# Altium schematic sheet Принципиальная схема_V_№2.SchDoc: Преобразователь
size 420 x 297 mm; CheckedBy: Эпштейн Л.Б.; Author: Гусев И.С.; CompanyName: ИЯФ СО РАН; DrawnBy: 32; Address1: Address1; Address2: Address2; Address3: Address3; Address4: Address4; DocumentNumber: АБВГ.123456.001 Э3; Revision: 0; SheetNumber: 1; SheetTotal: 1; Scale: 1:1; Letter1Column: 1; DocumentType: Схема электрическая принципиальная; FirstReferrence: АБВГ.123456.001; DocumentName: 12; Rule: PcbType=ProtelPcb
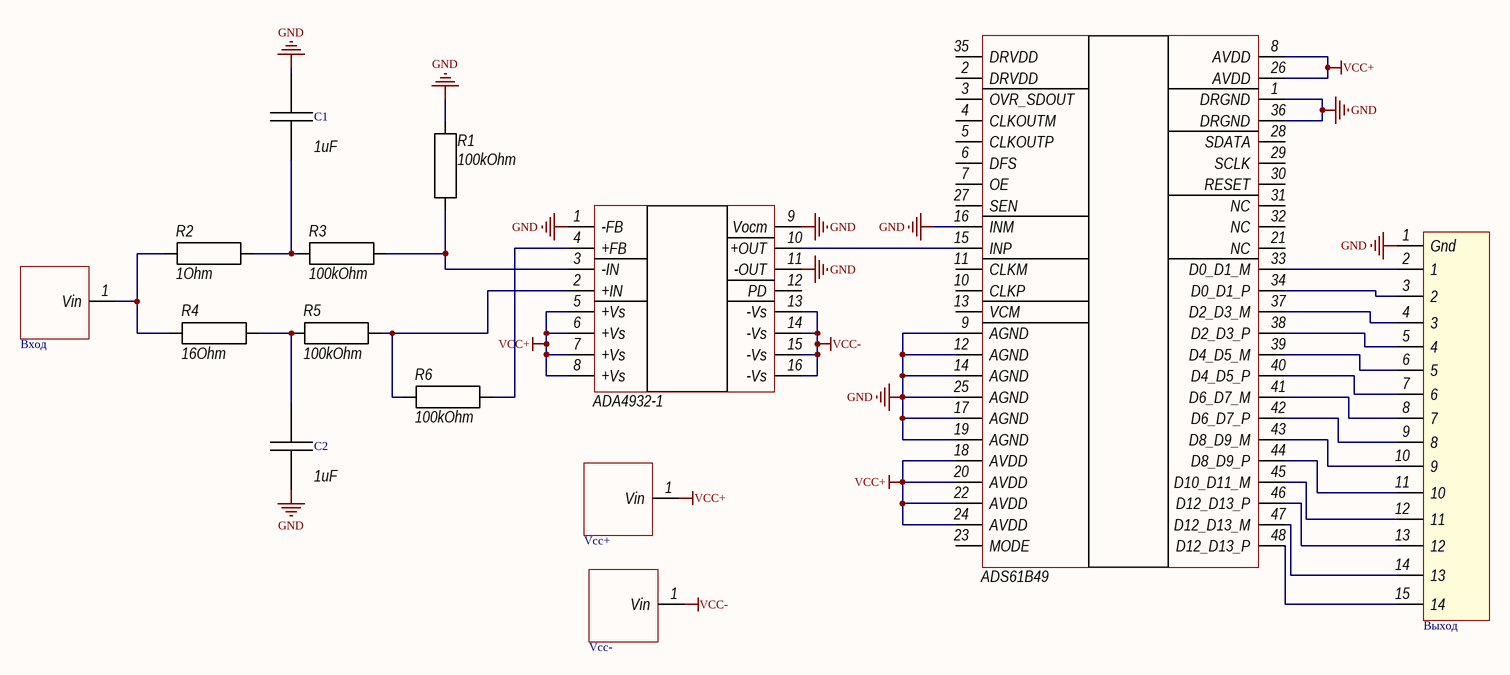
[diagram p0: Принципиальная схема_V_№2.SchDoc]

## Parts
*  Выход  [Выход]
ADA4932-1  ADA4932-1  [CP-16-2]  (value not drawn)
ADS61B49  ADS61B49  [VQFN-48]  (value not drawn)
C1  1uF  [Capasitor10X23]
C2  1uF  [Capasitor10X23]
R1  100kOhm  [SMD 0402]
R2  1Ohm  [SMD 0402]
R3  100kOhm  [SMD 0402]
R4  16Ohm  [SMD 0402]
R5  100kOhm  [SMD 0402]
R6  100kOhm  [SMD 0402]
Vcc+  Vcc+  [Вход]
Vcc-  Vcc-  [Вход]
Vin  Вход  [Вход]

## Nets
GND: *.1(Gnd) ADA4932-1.1(-FB) ADA4932-1.9(Vocm) ADA4932-1.11(-OUT) ADS61B49.1(DRGND) ADS61B49.9(AGND) ADS61B49.12(AGND) ADS61B49.14(AGND) ADS61B49.16(INM) ADS61B49.17(AGND) ADS61B49.19(AGND) ADS61B49.25(AGND) ADS61B49.36(DRGND) C1.1 C2.2 R1.2
VCC+: ADA4932-1.5(+Vs) ADA4932-1.6(+Vs) ADA4932-1.7(+Vs) ADA4932-1.8(+Vs) ADS61B49.8(AVDD) ADS61B49.18(AVDD) ADS61B49.20(AVDD) ADS61B49.22(AVDD) ADS61B49.24(AVDD) ADS61B49.26(AVDD) Vcc+.1(Vin)
VCC-: ADA4932-1.13(-Vs) ADA4932-1.14(-Vs) ADA4932-1.15(-Vs) ADA4932-1.16(-Vs) Vcc-.1(Vin)
Net*_2: *.2(1) ADS61B49.33(D0_D1_M)
Net*_3: *.3(2) ADS61B49.34(D0_D1_P)
Net*_4: *.4(3) ADS61B49.37(D2_D3_M)
Net*_5: *.5(4) ADS61B49.38(D2_D3_P)
Net*_6: *.6(5) ADS61B49.39(D4_D5_M)
Net*_7: *.7(6) ADS61B49.40(D4_D5_P)
Net*_8: *.8(7) ADS61B49.41(D6_D7_M)
Net*_9: *.9(8) ADS61B49.42(D6_D7_P)
Net*_10: *.10(9) ADS61B49.43(D8_D9_M)
Net*_11: *.11(10) ADS61B49.44(D8_D9_P)
Net*_12: *.12(11) ADS61B49.45(D10_D11_M)
Net*_13: *.13(12) ADS61B49.46(D12_D13_P)
Net*_14: *.14(13) ADS61B49.47(D12_D13_M)
Net*_15: *.15(14) ADS61B49.48(D12_D13_P)
NetADA4932-1_2: ADA4932-1.2(+IN) R5.2 R6.1
NetADA4932-1_3: ADA4932-1.3(-IN) R1.1 R3.2
NetADA4932-1_4: ADA4932-1.4(+FB) R6.2
NetADA4932-1_10: ADA4932-1.10(+OUT) ADS61B49.15(INP)
NetC1_2: C1.2 R2.2 R3.1
NetC2_1: C2.1 R4.2 R5.1
NetR2_1: R2.1 R4.1 Vin.1(Vin)

Not connected (* = marked no-connect by the designer): ADA4932-1 12(PD); ADS61B49 2(DRVDD) 3(OVR_SDOUT) 4(CLKOUTM) 5(CLKOUTP) 6(DFS) 7(OE) 10(CLKP) 11(CLKM) 13(VCM) 21(NC) 23(MODE) 27(SEN) 28(SDATA) 29(SCLK) 30(RESET) 31(NC) 32(NC) 35(DRVDD)

## Notes on the sheet
- Перв. примен.
- Справ. №
- Подп. и дата
- Инв. № дубл.
- Взам. инв. №
- Разраб.
- Изм.
- Лист
- № докум.
- Подп.
- Дата
- Лит.
- Масса
- Масштаб
- Пров.
- Т.контр.
- Листов
- Инв. № подл.
- Утв.
- Н.контр.
- 2.106-A3
- Копировал
- Формат А3

## Library data of the parts
C1 C2 = Capasitor: Value: 1uF
R1-R6 = Resistor: Value: *
Vcc+ Vcc- = Вход